# EAGLE design 1wire (EAGLE 6.6.0)
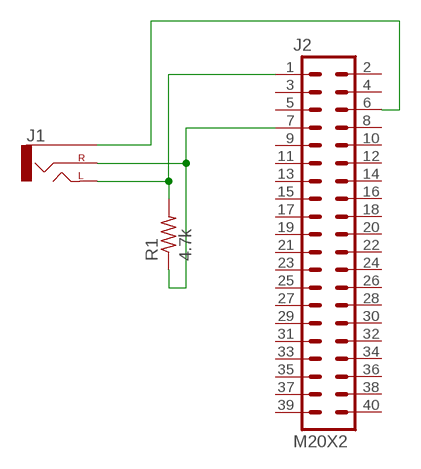
[diagram p0: schematic, sheet 1]

## Parts
J1  AUDIO-JACKPTH  [AUDIO-JACK]
J2  M20X2  [2X20]
R1  4.7k  R-US_R1206  [R1206]

## Nets
N$1: J1.TIP(LEFT) J2.1 R1.2
N$2: J1.RING(RIGHT) J2.7 R1.1
N$3: J1.SLEEVE J2.6
Unconnected: J2.2 J2.3 J2.4 J2.5 J2.8 J2.9 J2.10 J2.11 J2.12 J2.13 J2.14 J2.15 J2.16 J2.17 J2.18 J2.19 J2.20 J2.21 J2.22 J2.23 J2.24 J2.25 J2.26 J2.27 J2.28 J2.29 J2.30 J2.31 J2.32 J2.33 J2.34 J2.35 J2.36 J2.37 J2.38 J2.39 J2.40

## Library data of the parts
J1 = SparkFun-Connectors:AUDIO-JACK: 3.5mm Audio Jack Simple 3.5mm common PCB mount audio jack. Variant PTH is our storefront SKU PRT-08032
J2 = SparkFun-Connectors:M20X2: 0.1" spaced headers
R1 = rcl:R-US_: RESISTOR, American symbol

## Board
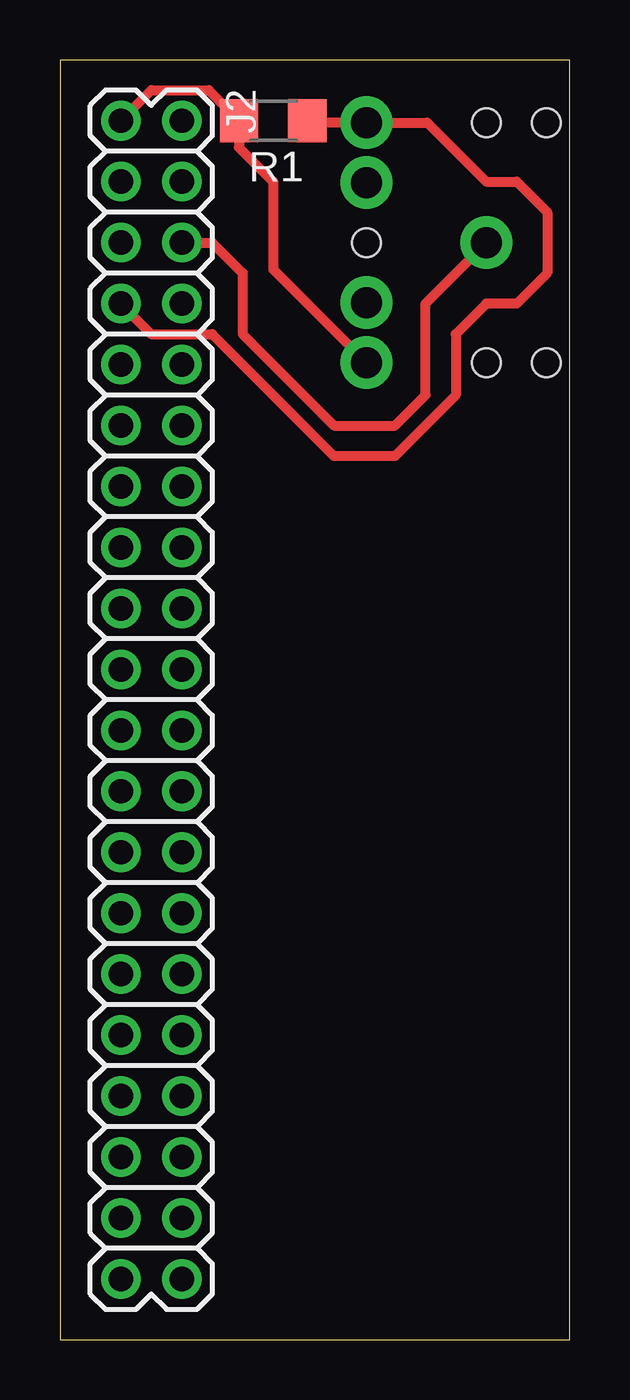
[diagram p1: board, top side]
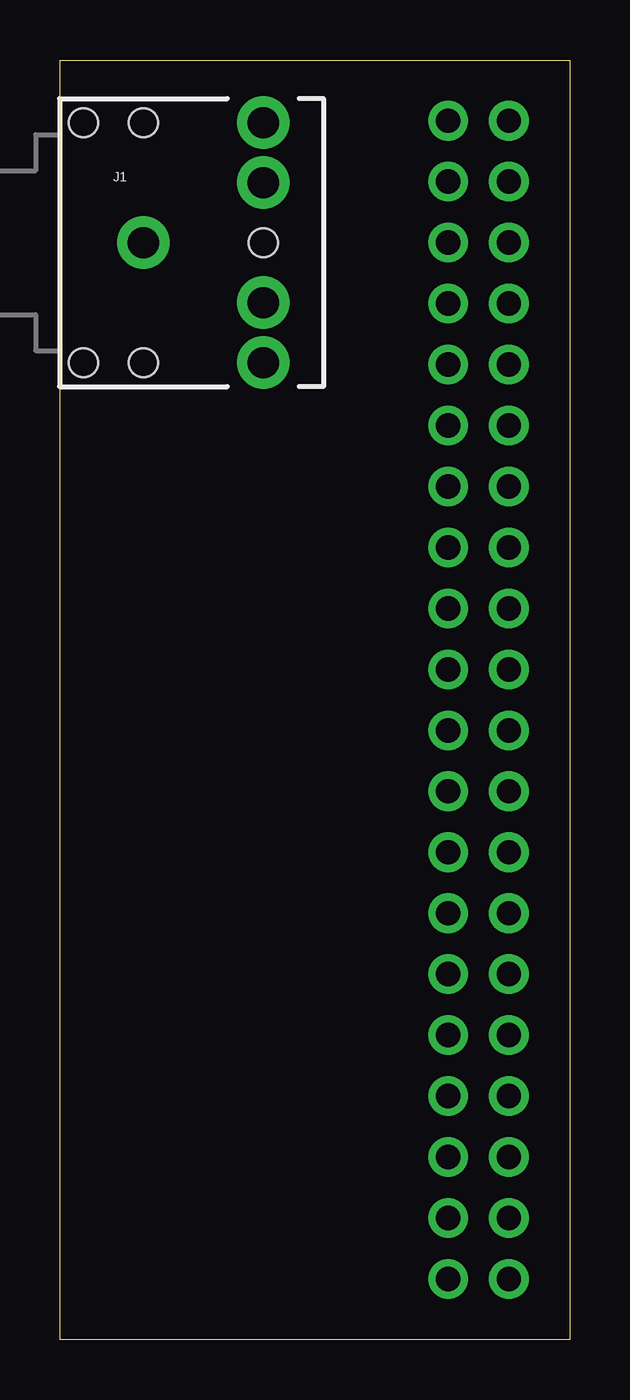
[diagram p2: board, bottom side, seen from below]

Size 21.26 x 53.33 mm. Coordinates in mm from the lower left corner, seen from the top.
Outline: 0,0 21.26,0 21.26,53.33 0,53.33 0,0
Copper layers (1*16): Top 0.035mm / dielectric 1.5mm / Bottom 0.035mm
Design rules "default": minimum track width 10mil, minimum drill 24mil, track to track 8mil, track to pad 8mil, pad to pad 8mil, via to via 8mil, smd to smd 8mil, copper to edge 40mil, drill to drill 8mil, minimum pad ring 10mil, minimum via ring 8mil, stop-mask expansion 4mil, vias tented up to drill 0mil, thermal gap 10mil
bKeepout: area 7.3,0 to 9.9,53.3

### Footprints (pad centres in the part's own frame; a part is rotated, then mirrored left to right if it is on the bottom)
AUDIO-JACK = drill 1.3 pad 2.184: RING 5,5; RSH 5,2.5; SLEEVE 0,0; TIP 5,-5; TSH 5,-2.5 | hole 1.2: 0,5; -2.5,5; -2.5,-5; 0,-5; 5,0
2X20 = drill 1.016 pad 1.651: 1 -24.13,-1.27; 2 -24.13,1.27; 3 -21.59,-1.27; 4 -21.59,1.27; 5 -19.05,-1.27; 6 -19.05,1.27; 7 -16.51,-1.27; 8 -16.51,1.27; 9 -13.97,-1.27; 10 -13.97,1.27; 11 -11.43,-1.27; 12 -11.43,1.27; 13 -8.89,-1.27; 14 -8.89,1.27; 15 -6.35,-1.27; 16 -6.35,1.27; 17 -3.81,-1.27; 18 -3.81,1.27; 19 -1.27,-1.27; 20 -1.27,1.27; 21 1.27,-1.27; 22 1.27,1.27; 23 3.81,-1.27; 24 3.81,1.27; 25 6.35,-1.27; 26 6.35,1.27; 27 8.89,-1.27; 28 8.89,1.27; 29 11.43,-1.27; 30 11.43,1.27; 31 13.97,-1.27; 32 13.97,1.27; 33 16.51,-1.27; 34 16.51,1.27; 35 19.05,-1.27; 36 19.05,1.27; 37 21.59,-1.27; 38 21.59,1.27; 39 24.13,-1.27; 40 24.13,1.27
R1206 = smd 1.6 x 1.803: 1 -1.422,0; 2 1.422,0

### Placement (x,y rotation side)
J1  17.78,45.72 0 bottom
J2  3.81,26.67 270 top
R1  8.89,50.8 180 top

### Tracks (layer width: path | path; a pad name or v marks a point on that pad's centre or on a via)
N$1
  Top 0.406: J2.1 3.81,52.07 6.2,52.07 R1.2 7.47,49.68 8.89,48.26 8.89,44.61 J1.TIP
N$2
  Top 0.406: J2.7 3.81,41.91 6.35,41.91 11.43,36.83 13.97,36.83 16.51,39.37 16.51,41.91 17.78,43.18 19.05,43.18 20.32,44.45 20.32,46.99 19.05,48.26 17.78,48.26 15.32,50.72 J1.RING 10.39,50.72 R1.1
N$3
  Top 0.406: J2.6 6.35,45.72 7.62,44.45 7.62,41.91 11.43,38.1 13.97,38.1 15.24,39.37 15.24,43.18 J1.SLEEVE